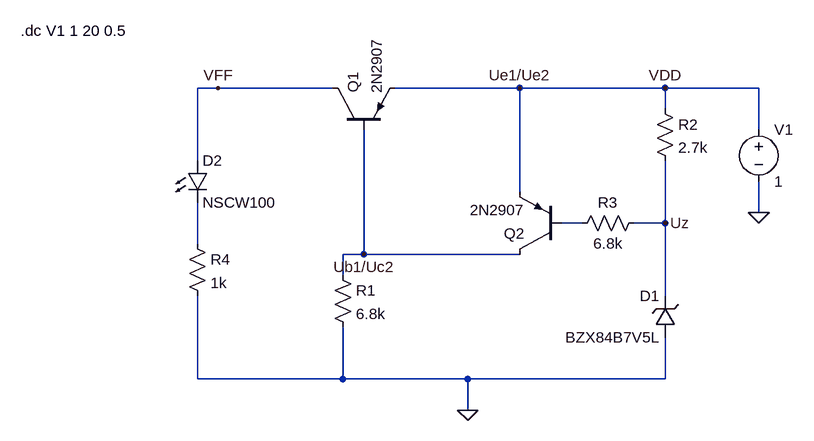
[diagram p0: schematic 9_Voltage_Protection_simple.asc]
9_Voltage_Protection_simple.asc, the LTspice schematic file:
Version 4
SHEET 1 1848 724
WIRE 880 208 848 208
WIRE 1056 208 880 208
WIRE 1344 208 1152 208
WIRE 1568 208 1344 208
WIRE 1712 208 1568 208
WIRE 1568 240 1568 208
WIRE 1712 272 1712 208
WIRE 848 320 848 208
WIRE 1344 368 1344 208
WIRE 1712 400 1712 352
WIRE 1440 416 1408 416
WIRE 1568 416 1568 320
WIRE 1568 416 1520 416
WIRE 848 448 848 384
WIRE 1104 464 1104 272
WIRE 1104 464 1072 464
WIRE 1344 464 1104 464
WIRE 1072 496 1072 464
WIRE 1568 528 1568 416
WIRE 848 656 848 528
WIRE 1072 656 1072 576
WIRE 1072 656 848 656
WIRE 1264 656 1072 656
WIRE 1568 656 1568 592
WIRE 1568 656 1264 656
WIRE 1264 704 1264 656
FLAG 1712 400 0
FLAG 1264 704 0
FLAG 880 208 VFF
FLAG 1568 208 VDD
FLAG 1568 416 Uz
FLAG 1104 464 Ub1/Uc2
FLAG 1344 208 Ue1/Ue2
SYMBOL pnp 1056 272 R270
SYMATTR InstName Q1
SYMATTR Value 2N2907
SYMBOL pnp 1408 464 R180
SYMATTR InstName Q2
SYMATTR Value 2N2907
SYMBOL res 1056 480 R0
SYMATTR InstName R1
SYMATTR Value 6.8k
SYMATTR SpiceLine tol=1
SYMBOL res 1552 224 R0
SYMATTR InstName R2
SYMATTR Value 2.7k
SYMATTR SpiceLine tol=1
SYMBOL res 1536 400 R90
WINDOW 0 0 56 VBottom 2
WINDOW 3 32 56 VTop 2
SYMATTR InstName R3
SYMATTR Value 6.8k
SYMATTR SpiceLine tol=1
SYMBOL zener 1584 592 R180
WINDOW 0 24 64 Left 2
WINDOW 3 24 0 Left 2
SYMATTR InstName D1
SYMATTR Value BZX84B7V5L
SYMATTR Description Diode
SYMATTR Type diode
SYMBOL voltage 1712 256 R0
WINDOW 123 0 0 Left 2
WINDOW 39 0 0 Left 2
SYMATTR InstName V1
SYMATTR Value 1
SYMBOL res 832 432 R0
SYMATTR InstName R4
SYMATTR Value 1k
SYMATTR SpiceLine tol=1
SYMBOL LED 832 320 R0
SYMATTR InstName D2
SYMATTR Value NSCW100
SYMATTR Description Diode
SYMATTR Type diode
TEXT 576 120 Left 2 !.dc V1 1 20 0.5

The netlist it stands for:
* 9_Voltage_Protection_simple.asc
Q1 VFF Ub1/Uc2 Ue1/Ue2 0 2N2907
Q2 Ub1/Uc2 N001 Ue1/Ue2 0 2N2907
R1 Ub1/Uc2 0 6.8k tol=1
R2 Ue1/Ue2 Uz 2.7k tol=1
R3 Uz N001 6.8k tol=1
D1 0 Uz BZX84B7V5L
V1 Ue1/Ue2 0 1
R4 N002 0 1k tol=1
D2 VFF N002 NSCW100
.model D D
.lib standard.dio
.model NPN NPN
.model PNP PNP
.lib standard.bjt
.dc V1 1 20 0.5
.backanno
.end